# EAGLE design solar_switch (EAGLE 9.0.1)
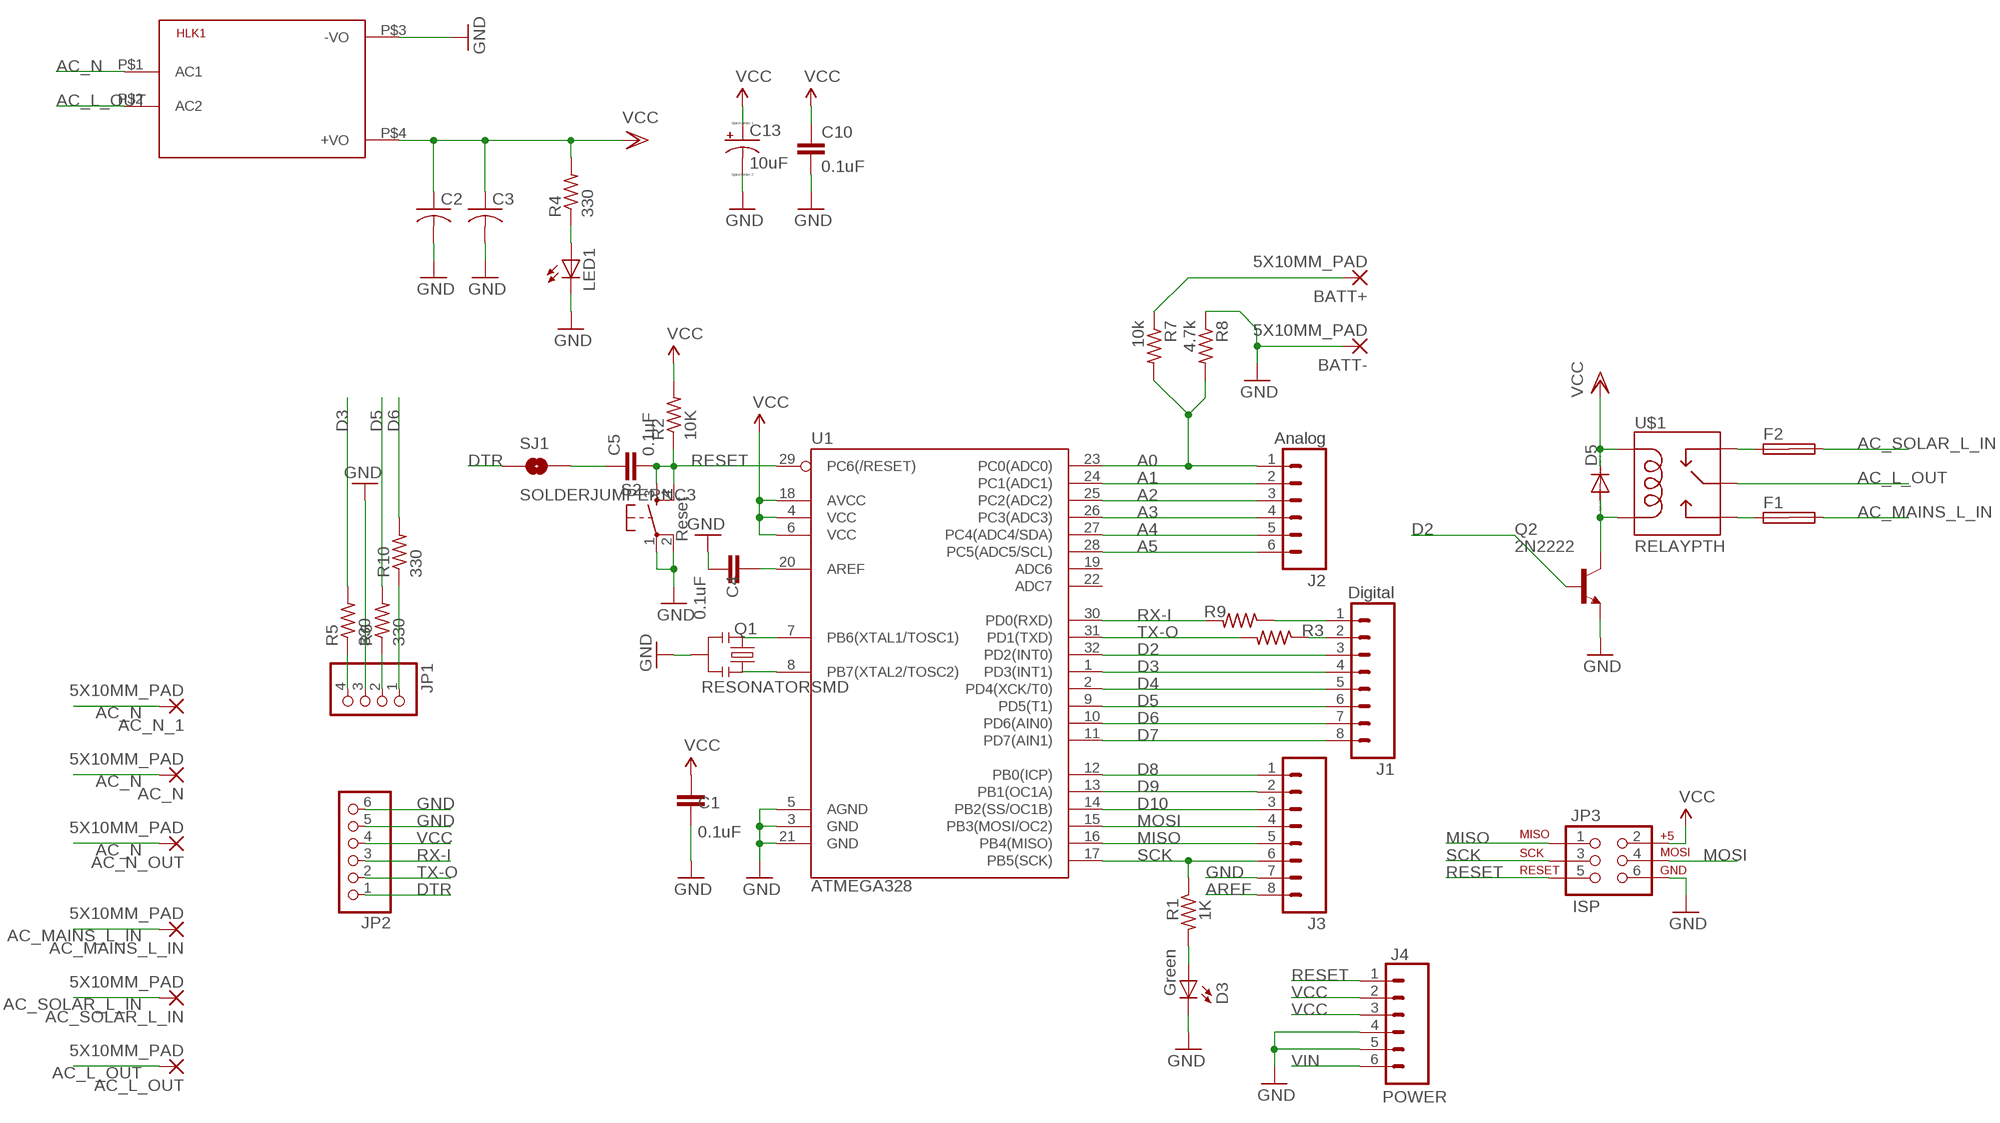
[diagram p0: schematic, sheet 1]

## Parts
AC_L_OUT  5X10MM_PAD  [SMD5-10]
AC_MAINS_L_IN  5X10MM_PAD  [SMD5-10]
AC_N  5X10MM_PAD  [SMD5-10]
AC_N_1  5X10MM_PAD  [SMD5-10]
AC_N_OUT  5X10MM_PAD  [SMD5-10]
AC_SOLAR_L_IN  5X10MM_PAD  [SMD5-10]
BATT+  5X10MM_PAD  [SMD5-10]
BATT-  5X10MM_PAD  [SMD5-10]
C1  0.1uF  C-EUC0805  [C0805]
C2  C-USC0805K  [C0805K]
C3  C-USC0805K  [C0805K]
C4  0.1uF  C-EUC0805  [C0805]
C5  0.1uF  C-EUC0805  [C0805]
C10  0.1uF  C-EUC0805  [C0805]
C13  10uF  CPOL-USB  [PANASONIC_B]
D3  Green  LEDCHIP-LED0805  [CHIP-LED0805]
D5  1N4004  [DO41-10]
F1  SHKOG  [SHKOG]
F2  SHKOG  [SHKOG]
HLK1  HLK-PM013W  [HLK-PM01]
J1  Digital  M081X08  [1X08]
J2  Analog  M06SIP  [1X06]
J3  M081X08  [1X08]
J4  POWER  M06SIP  [1X06]
JP1  PINHD-1X4  [1X04]
JP2  PINHD-1X6  [1X06]
JP3  ISP  AVR_SPI_PRG_6PTH  [2X3]
LED1  LEDCHIPLED_0805  [CHIPLED_0805]
Q1  RESONATORSMD  [RESONATOR-SMD]
Q2  2N2222  [TO18]
R1  1K  R-US_R0805  [R0805]
R2  10K  R-US_R0805  [R0805]
R3  220  R-US_R0805  [R0805]
R4  330  R-US_R0805  [R0805]
R5  330  R-US_R0805  [R0805]
R6  330  R-US_R0805  [R0805]
R7  10k  R-US_M0805  [M0805]
R8  4.7k  R-US_M0805  [M0805]
R9  220  R-US_R0805  [R0805]
R10  330  R-US_R0805  [R0805]
S2  Reset  TAC_SWITCHSMD  [TACTILE_SWITCH_SMD]
SJ1  SOLDERJUMPERNC3  SOLDERJUMPERNC2  [SJ_2S-NOTRACE]
U1  ATMEGA328  ATMEGA168  [TQFP32-08]
U$1  RELAYPTH  [SRD-05VDC-SL-C]

## Nets
A0: J2.1 R7.2 R8.2 U1.23(PC0(ADC0))
A1: J2.2 U1.24(PC1(ADC1))
A2: J2.3 U1.25(PC2(ADC2))
A3: J2.4 U1.26(PC3(ADC3))
A4: J2.5 U1.27(PC4(ADC4/SDA))
A5: J2.6 U1.28(PC5(ADC5/SCL))
AC_L_OUT: AC_L_OUT.1(P) HLK1.P$2(AC2) U$1.SWCOMMON
AC_MAINS_L_IN: AC_MAINS_L_IN.1(P) F1.2A
AC_N: AC_N.1(P) AC_N_1.1(P) AC_N_OUT.1(P) HLK1.P$1(AC1)
AC_SOLAR_L_IN: AC_SOLAR_L_IN.1(P) F2.2A
AREF: C4.2 J3.8 U1.20(AREF)
D2: J1.3 Q2.2(B) U1.32(PD2(INT0))
D3: J1.4 R5.2 U1.1(PD3(INT1))
D4: J1.5 U1.2(PD4(XCK/T0))
D5: J1.6 R6.2 U1.9(PD5(T1))
D6: J1.7 R10.2 U1.10(PD6(AIN0))
D7: J1.8 U1.11(PD7(AIN1))
D8: J3.1 U1.12(PB0(ICP))
D9: J3.2 U1.13(PB1(OC1A))
D10: J3.3 U1.14(PB2(SS/OC1B))
DTR: JP2.1 SJ1.1
GND: BATT-.1(P) C1.1 C2.2 C3.2 C4.1 C10.2 C13.- D3.C HLK1.P$3(-VO) J3.7 J4.4 J4.5 JP1.3 JP2.5 JP2.6 JP3.6 LED1.C Q1.2 Q2.1(E) R8.1 S2.1 S2.2 U1.3(GND) U1.5(AGND) U1.21(GND)
MISO: J3.5 JP3.1 U1.16(PB4(MISO))
MOSI: J3.4 JP3.4 U1.15(PB3(MOSI/OC2))
N$1: D3.A R1.2
N$2: C5.1 SJ1.2
N$3: Q1.1 U1.8(PB7(XTAL2/TOSC2))
N$4: Q1.3 U1.7(PB6(XTAL1/TOSC1))
N$6: LED1.A R4.1
N$7: JP1.1 R10.1
N$8: F2.1A U$1.SWCLOSED(SWCLOSE)
N$9: F1.1A U$1.SWOPEN
N$10: JP1.4 R5.1
N$11: JP1.2 R6.1
N$12: D5.A Q2.3(C) U$1.COIL0
N$13: BATT+.1(P) R7.1
RESET: C5.2 J4.1 JP3.5 R2.1 S2.3 S2.4 U1.29(PC6(/RESET))
RX-I: JP2.3 R9.2 U1.30(PD0(RXD))
RX-IP: J1.2 R3.1
SCK: J3.6 JP3.3 R1.1 U1.17(PB5(SCK))
TX-O: JP2.2 R3.2 U1.31(PD1(TXD))
TX-OP: J1.1 R9.1
VCC: C1.2 C2.1 C3.1 C10.1 C13.+ D5.C HLK1.P$4(+VO) J4.2 J4.3 JP2.4 JP3.2 R2.2 R4.2 U1.4(VCC) U1.6(VCC) U1.18(AVCC) U$1.COIL1
VIN [vcc]: J4.6
Unconnected: F1.1B F1.2B F2.1B F2.2B U1.19(ADC6) U1.22(ADC7)

## Library data of the parts
AC_L_OUT AC_MAINS_L_IN AC_N AC_N_1 AC_N_OUT AC_SOLAR_L_IN BATT+ BATT- = _my_lib:5X10MM_PAD
C1 C4 C5 = rcl:C-EU: CAPACITOR, European symbol
C2 C3 = resistor:C-US: CAPACITOR, American symbol
C10 = rcl:C-EU: CAPACITOR, European symbol; SPICEPREFIX: C
C13 = resistor:CPOL-US: POLARIZED CAPACITOR, American symbol
D3 = adafruit:LED: LED
D5 = diode:1N4004: DIODE general purpose rectifier, 1 A
F1 F2 = fuse:SHKOG: FUSE HOLDER 5 x 20/6 x 32 mm, SH contact, OG 46G6083 Buerklin; OC_FARNELL: unknown; OC_NEWARK: unknown
HLK1 = HLK-PM01:HLK-PM01: Hi-Link Power Supply HLK-PM01 3W Author: Ahmed Said <https://github.com/AhmedSaid/EAGLELibraries>
J1 J3 = SparkFun:M08: Header 8 Standard 8-pin 0.1" header. Use with straight break away headers (SKU : PRT-00116), right angle break away headers (PRT-00553), swiss pins (PRT-00743), machine pins (PRT-00117), and female headers (PRT-00115).
J2 J4 = SparkFun:M06: Header 6 Standard 6-pin 0.1" header. Use with straight break away headers (SKU : PRT-00116), right angle break away headers (PRT-00553), swiss pins (PRT-00743), machine pins (PRT-00117), and female headers (PRT-00115). Molex polarized connector foot print use with SKU : PRT-08094 with associated crimp pins and housings. NOTES ON THE VARIANTS LOCK and LOCK_LONGPADS... This footprint was designed to help hold the alignment of a through-hole component (i.e. 6-pin header) while soldering it into place. You may notice that each hole has been shifted either up or down by 0.005 of an inch from it's more standard position (which is a perfectly straight line). This slight alteration caused the pins (the squares in the middle) to touch the edges of the holes. Because they are alternating, it causes a "brace" to hold the component in place. 0.005 has proven to be the perfect amount of "off-center" position when using our standard breakaway headers. Although looks a little odd when you look at the bare footprint, once you have a header in there, the alteration is very hard to notice. Also, if you push a header all the way into place, it is covered up entirely on the bottom side. This idea of altering the position of holes to aid alignment will be further integrated into the Sparkfun Library for other footprints. It can help hold any component with 3 or more connection pins.
JP1 = pinhead:PINHD-1X4: PIN HEADER
JP2 = pinhead:PINHD-1X6: PIN HEADER
JP3 = SparkFun:AVR_SPI_PRG_6: AVR ISP 6 Pin This is the reduced ISP connector for AVR programming. Common on Arduino. This footprint will take up less PCB space and can be used with a 10-pin to 6-pin adapter such as SKU: BOB-08508
LED1 = led:LED: LED
Q1 = SparkFun:RESONATOR: Resonator Small SMD resonator. This is the itty bitty 10/20MHz resonators with built in caps. CSTCE10M0G55 and CSTCE20M0V53. Footprint has been reviewed closely but hasn't been tested yet.
Q2 = transistor-npn:2N2222*: NPN Transistor
R1-R6 R9 R10 = rcl:R-US_: RESISTOR, American symbol
R7 R8 = resistor:R-US_: RESISTOR, American symbol
S2 = SparkFun:TAC_SWITCH: Momentary Switch Button commonly used for reset or general input. Spark Fun Electronics SKU : COM-00097
SJ1 = SparkFun:SOLDERJUMPER: Solder Jumper Standard SMD solder jumper. Used to automate production. Two varients : Normally Open and Normally Closed are the same, but have different paste layers. NC will have a large amount of paste and should jumper during reflow.
U1 = SparkFun:ATMEGA168
U$1 = SRD-05VDC-SL-C:RELAY: SPDT relay (COM-00101)

## Net classes
0 default: width 0.203 mm
1 vcc: width 0.254 mm

## Board
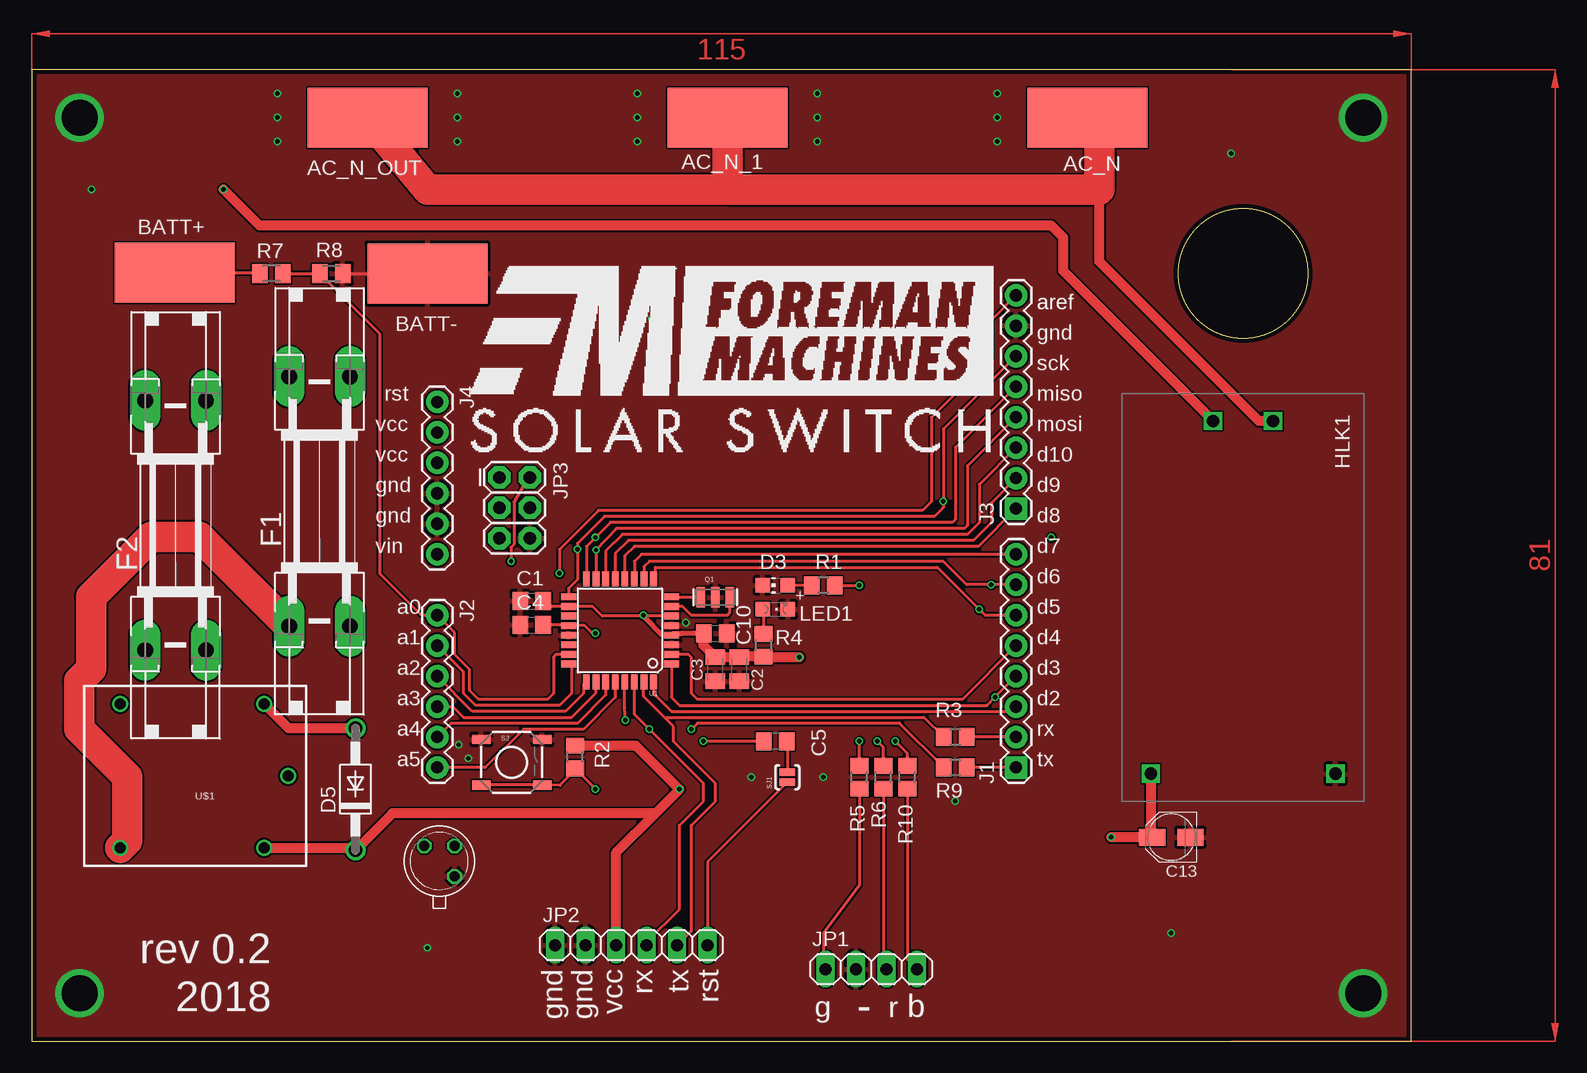
[diagram p1: board, top side]
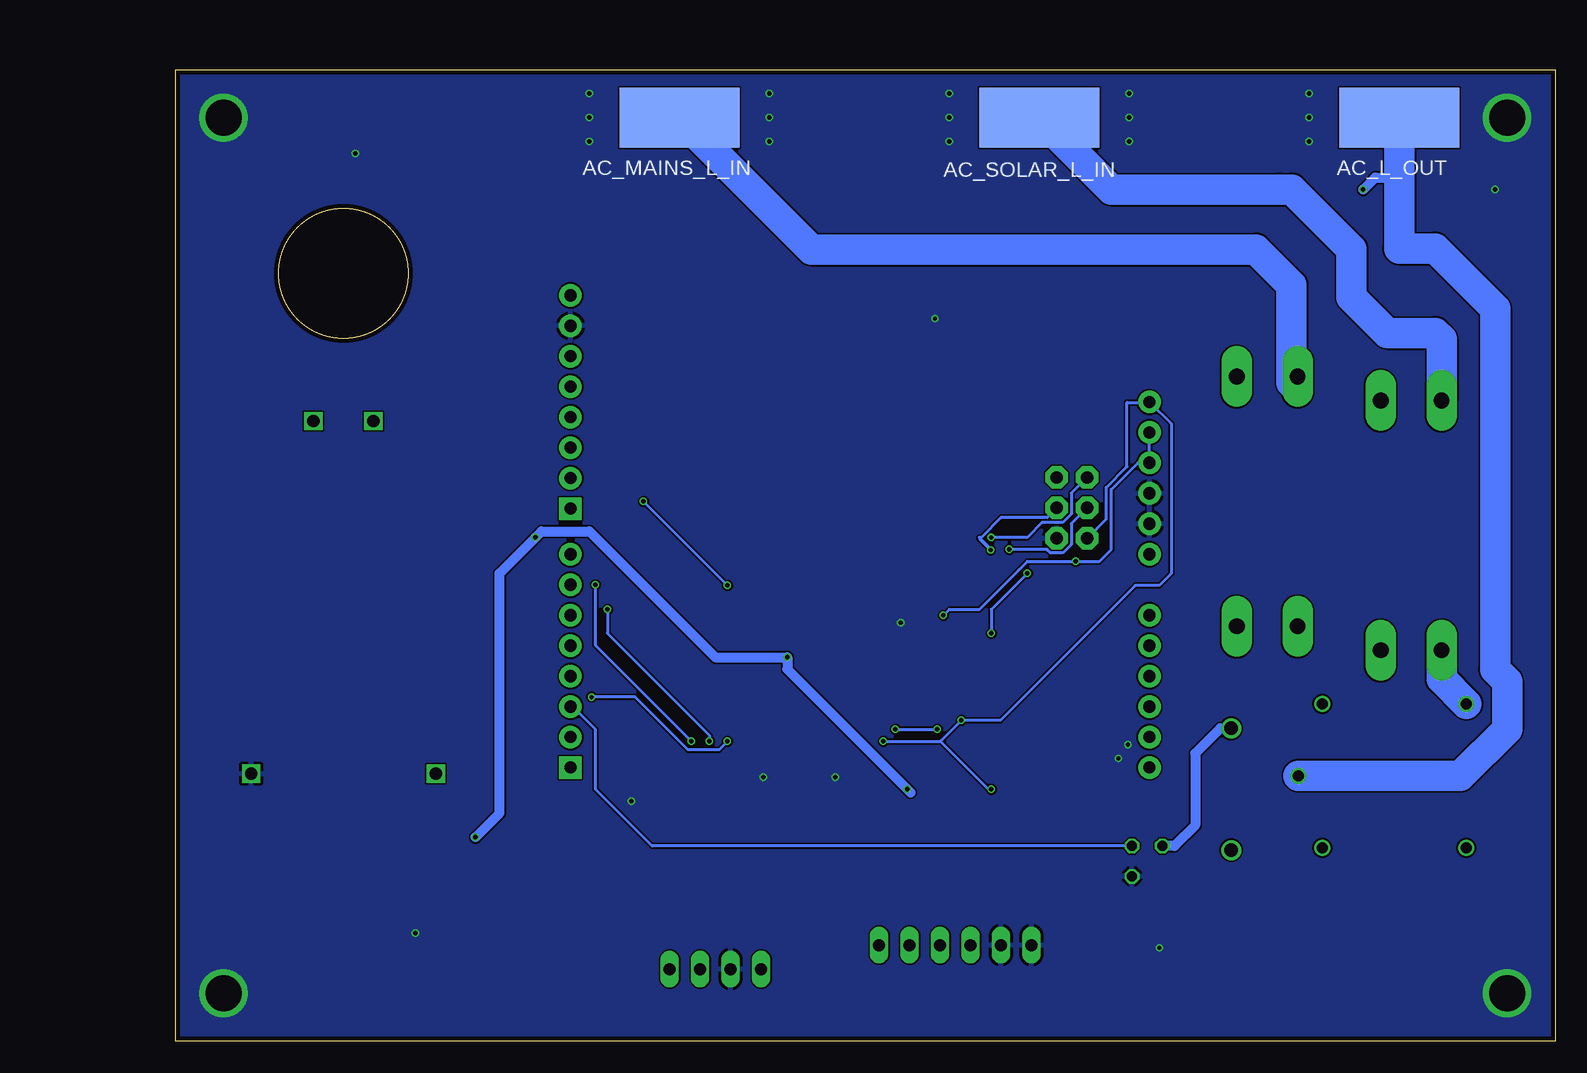
[diagram p2: board, bottom side, seen from below]

Size 115 x 81 mm. Coordinates in mm from the lower left corner, seen from the top.
Outline: 0,0 115,0 115,81 0,81 0,0
Outline: circle at 101,64 radius 5.39
Copper layers (1*16): Top 0.035559375mm / dielectric 1.6mm / Bottom 0.035559375mm
Design rules "oshpark-2layer": minimum track width 6mil, minimum drill 10mil, track to track 6mil, track to pad 6mil, pad to pad 6mil, via to via 6mil, smd to smd 6mil, copper to edge 15mil, drill to drill 6mil, minimum pad ring 5mil, minimum via ring 5mil, stop-mask expansion 2.5mil, vias tented up to drill 0mil, thermal gap 10mil

### Footprints (pad centres in the part's own frame; a part is rotated, then mirrored left to right if it is on the bottom)
SMD5-10 = smd 5 x 10: 1 0,0
C0805 = smd 1.3 x 1.5: 1 -0.95,0; 2 0.95,0
C0805K = smd 1.3 x 1.6: 1 -1,0; 2 1,0
PANASONIC_B = smd 2.2 x 1.4: + 1.6,0; - -1.6,0
CHIP-LED0805 = smd 1.2 x 1.2: A 0,-1.05; C 0,1.05
DO41-10 = drill 1.118: A 5.08,0; C -5.08,0
SHKOG = drill 1.321 pad 2.54 long: 1A -10.414,2.54; 1B -10.414,-2.54; 2A 10.414,2.54; 2B 10.414,-2.54
HLK-PM01 = drill 1.016 square: P$1 -14.7,2.5; P$2 -14.7,-2.5; P$3 14.7,7.7; P$4 14.7,-7.7
1X08 = drill 1.016 pad 1.88 square: 1 0,0 | drill 1.016 pad 1.88: 2 2.54,0; 3 5.08,0; 4 7.62,0; 5 10.16,0; 6 12.7,0; 7 15.24,0; 8 17.78,0
1X06 = drill 1.016 pad 1.88: 1 0,0; 2 2.54,0; 3 5.08,0; 4 7.62,0; 5 10.16,0; 6 12.7,0
1X04 = drill 1.016 long: 1 -3.81,0; 2 -1.27,0; 3 1.27,0; 4 3.81,0
1X06' = drill 1.016 long: 1 -6.35,0; 2 -3.81,0; 3 -1.27,0; 4 1.27,0; 5 3.81,0; 6 6.35,0
2X3 = drill 1.016 pad 1.88 octagon: 1 0,0; 2 0,2.54; 3 2.54,0; 4 2.54,2.54; 5 5.08,0; 6 5.08,2.54
CHIPLED_0805 = smd 1.2 x 1.2: A 0,-1.05; C 0,1.05
RESONATOR-SMD = smd 0.7 x 1.7: 1 -1.2,0; 2 0,0; 3 1.2,0
TO18 = drill 0.813 octagon: 1 -1.27,-1.27; 2 1.27,-1.27; 3 1.27,1.27
R0805 = smd 1.3 x 1.5: 1 -0.95,0; 2 0.95,0
M0805 = smd 1.3 x 1.6: 1 -0.95,0; 2 0.95,0
TACTILE_SWITCH_SMD = smd 1.524 x 0.762: 1 -2.54,1.905; 2 2.54,1.905; 3 -2.54,-1.905; 4 2.54,-1.905
SJ_2S-NOTRACE = smd 0.635 x 1.27: 1 -0.401,0; 2 0.413,0
TQFP32-08 = smd 1.27 x 0.559: 1 -4.293,2.8; 2 -4.293,2; 3 -4.293,1.2; 4 -4.293,0.4; 5 -4.293,-0.4; 6 -4.293,-1.2; 7 -4.293,-2; 8 -4.293,-2.8; 17 4.293,-2.8; 18 4.293,-2; 19 4.293,-1.2; 20 4.293,-0.4; 21 4.293,0.4; 22 4.293,1.2; 23 4.293,2; 24 4.293,2.8 | smd 0.559 x 1.27: 9 -2.8,-4.293; 10 -2,-4.293; 11 -1.2,-4.293; 12 -0.4,-4.293; 13 0.4,-4.293; 14 1.2,-4.293; 15 2,-4.293; 16 2.8,-4.293; 25 2.8,4.293; 26 2,4.293; 27 1.2,4.293; 28 0.4,4.293; 29 -0.4,4.293; 30 -1.2,4.293; 31 -2,4.293; 32 -2.8,4.293
SRD-05VDC-SL-C = drill 0.9: COIL0 -5.39,-6.12; COIL1 -5.39,5.88; SWCLOSED 6.61,-6.12; SWCOMMON -7.39,-0.12; SWOPEN 6.61,5.88

### Placement (x,y rotation side)
AC_L_OUT  13,77 90 bottom
AC_MAINS_L_IN  73,77 90 bottom
AC_N  88,77 270 top
AC_N_1  58,77 90 top
AC_N_OUT  28,77 90 top
AC_SOLAR_L_IN  43,77 270 bottom
BATT+  11.93,64.07 90 top
BATT-  33,64 90 top
C1  41.69,36.7 0 top
C2  59,31 270 top
C3  57,31 270 top
C4  41.69,34.7 0 top
C5  62,25 180 top
C10  57,34 0 top
C13  95,17 180 top
D3  62,38 90 top
D5  27,21 90 top
F1  24,45 90 top
F2  12,43 90 top
HLK1  101,37 270 top
J1  82.07,22.81 90 top
J2  33.81,35.51 270 top
J3  82.07,44.4 90 top
J4  33.81,53.29 270 top
JP1  70,6 180 top
JP2  [1X06']  50,8 180 top
JP3  39,47 270 top
LED1  62,36 270 top
Q1  57,37 0 top
Q2  34,15 90 top
R1  66,38 180 top
R2  45.3,23.69 90 top
R3  76.99,25.35 180 top
R4  61,33 270 top
R5  69,22 90 top
R6  71,22 90 top
R7  20,64 0 top
R8  25,64 180 top
R9  76.99,22.81 180 top
R10  73,22 90 top
S2  40.03,23.25 0 top
SJ1  63,22 90 top
U1  49.05,34.24 180 top
U$1  14,22 180 top

### Tracks (layer width: path | path; a pad name or v marks a point on that pad's centre or on a via)
A0
  Top 0.254: U1.23 43.74,32.24 43.5,32 43.5,29 43,28.5 37.25,28.5 36.5,29.25 36.5,31 35.25,32.25 35.25,34.07 J2.1 32.49,35.51 29,39 29,59 24.05,63.95 R8.2 R7.2
A1
  Top 0.254: U1.24 45,31.2 45,29 44,28 37,28 36,29 36,30.78 J2.2
A2
  Top 0.254: U1.25 46,29.7 46,29 44.5,27.5 36.74,27.5 J2.3
A3
  Top 0.254: J2.4 35.11,27.89 36,27 45,27 47.05,29.05 U1.26
A4
  Top 0.254: U1.27 47.85,28.85 45.5,26.5 34.96,26.5 J2.5
A5
  Top 0.254: U1.28 48.65,28.65 46,26 41,26 37.81,22.81 J2.6
AC_L_OUT  (via drill 0.35)
  Top 0.813: HLK1.P$2 86,64.2 86,67 85,68 19,68 v16,71
  Bottom 0.813: v16,71 15,72 13,72
  Bottom 2.54: AC_L_OUT.1 13,72 13,66.08 10,66.08 5,61.08 5,31 4,30 4,26 7.88,22.12 U$1.SWCOMMON
AC_MAINS_L_IN
  Bottom 2.54: AC_MAINS_L_IN.1 62,66 24.93,66 21.97,63.03 21.97,54.92 F1.2A
AC_N
  Top 0.813: HLK1.P$1 102.3,51.7 89,65 89,71
  Top 2.54: 58,71 89,71 89,76 AC_N.1 | AC_N_1.1 58,71 | AC_N_OUT.1 33,71 58,71
AC_SOLAR_L_IN
  Bottom 2.54: AC_SOLAR_L_IN.1 37,71 23,71 21.93,71 16.97,66.03 16.97,64.03 16.97,62.03 13.97,59.03 9.97,59.03 9.46,58.53 F2.2A
AREF  (via drill 0.35)
  Top 0.254: C4.2 44.7,34.7 U1.20 46.11,34.64 46.75,34 v47,34 | J3.8 80,60.11 80,57 75,52 75,45 74.25,44.25 47.25,44.25 44,41 v44,39
  Bottom 0.254: v44,39 47,36 v47,34
D2
  Top 0.254: U1.32 51.85,29 | 51.85,29 51.85,28.9 | 51.85,29 53.35,27.5 81.68,27.5 J1.3
  Bottom 0.254: Q2.2 75.27,16.27 80,21 80,26 81.89,27.89 J1.3
D3  (via drill 0.35)
  Top 0.254: U1.1 53.34,28.66 54,28 79.64,28 v80.32,28.68 J1.4 | R5.2 v69,25
  Bottom 0.254: v69,25 69.71,24.29 72.29,24.29 76.68,28.68 v80.32,28.68
D4
  Top 0.254: U1.2 54.76,32.24 55,32 55,29 55.5,28.5 77.6,28.5 J1.5
D5  (via drill 0.35)
  Top 0.254: J1.6 79.49,35.51 v79,36 75.5,39.5 52,39.5 52,38.68 U1.9 | R6.2 71,24.5 v70.5,25
  Bottom 0.254: v79,36 79,34 70.5,25.5 v70.5,25
D6  (via drill 0.35)
  Top 0.254: J1.7 v80,38.05 77.95,38.05 76,40 51.5,40 51.05,39.55 U1.10 51.05,38.95 51,39 | R10.2 73,24 v72,25
  Bottom 0.254: v72,25 80,33 v80,38.05
D7
  Top 0.254: J1.8 50.84,40.59 50.25,40 U1.11
D8
  Top 0.254: J3.1 78.92,41.25 50.25,41.25 49.45,40.45 U1.12
D9
  Top 0.254: J3.2 80,44.87 80,43.25 78.5,41.75 49.75,41.75 48.65,40.65 U1.13
D10
  Top 0.254: J3.3 79,46.41 79,43.25 78,42.25 49.25,42.25 47.85,40.85 U1.14
DTR
  Top 0.254: JP2.1 56.35,14.95 SJ1.1
GND  (via drill 0.35, 3)
  Top 0.254: R8.1 31.93,64 31.97,64.03 32.97,64.03 BATT-.1
  other vias: 4,4 111,4 111,77 4,77 60,22 66,22 77,20 5,71 100,74 51.7,60.24 95,9 32.99,7.77 80.5,75 80.5,77 80.5,79 20.5,75 20.5,77 20.5,79 35.5,75 35.5,77 35.5,79 50.5,75 50.5,77 50.5,79 65.5,75 65.5,77 65.5,79 54.54,34.89 36.41,23.58 35.6,24.72
  pour Top: -22.03,104.53 143.47,107.53 143.47,-17.97 -21.03,-17.97
  pour Bottom: -25.03,108.03 144.97,109.03 144.97,-19.47 -26.03,-20.97
MISO  (via drill 0.35)
  Top 0.254: J3.5 77,49.49 77,43.5 76.75,43.25 48.25,43.25 v47,42 | v47,42 46.25,41.25 U1.16 | v47,42
  Bottom 0.254: v47,42 44,42 42.76,43.24 41.04,43.24 40.32,43.95 40.32,45.68 JP3.1
MOSI  (via drill 0.35)
  Top 0.254: J3.4 78,47.95 78,43 77.75,42.75 48.75,42.75 v47.05,40.95 U1.15
  Bottom 0.254: 47.97,41.87 v47.05,40.95 47.05,41.05 47.29,41.29 47.71,41.71 48,42 47.82,42 46.18,43.65 42.35,43.65 JP3.4
N$1
  Top 0.254: R1.2 D3.A
N$2
  Top 0.254: C5.1 63,24.95 SJ1.2
N$3
  Top 0.254: U1.8 55.76,37.04 Q1.1
N$4
  Top 0.254: Q1.3 58.2,35.7 58,35.5 55,35.5 54.26,36.24 U1.7
N$6
  Top 0.254: LED1.A 61,35.95 R4.1
N$7
  Top 0.254: R10.1 73,6.81 JP1.1
N$8
  Bottom 2.54: U$1.SWCLOSED 9.46,30.19 F2.1A
N$9
  Top 2.54: F1.1A 14.01,42.03 9.97,42.03 4.97,37.03 4.97,31.03 3.97,30.03 3.97,26.03 7.97,22.03 7.97,16.7 U$1.SWOPEN
N$10
  Top 0.254: 66.19,7.24 JP1.4 66,6.19 66,9 69,13 R5.1
N$11
  Top 0.254: R6.1 71,6.27 JP1.2
N$12
  Top 0.813: D5.A 21.43,26.08 U$1.COIL0
  Bottom 0.813: D5.A 27.92,26.08 30,24 30,18 31.73,16.27 Q2.3
N$13
  Top 0.254: BATT+.1 18.98,64.07 R7.1
RESET  (via drill 0.35)
  Top 0.254: C5.2 v56,25 | v49.5,26.75 49.45,27.8 U1.29 49.5,30 | 44.07,21.32 44.01,21.32 | 44.01,21.32 S2.4 S2.3 | J4.1 33.84,53.26 | 44.01,21.32 45.3,22.62 R2.1 47,21.04 v47,21
  Bottom 0.254: v56,25 51.25,25 | 51.25,25 v49.5,26.75 46.25,26.75 35,38 33,38 32,39 32,51.48 33.76,53.24 | v47,21 47.25,21 51.25,25 | J4.1 33.76,53.24 | 33.76,53.24 35.68,53.24 35.68,47.9 37.41,46.17 37.41,43.51 JP3.5
RX-I  (via drill 0.35)
  Top 0.254: 50.32,29.88 U1.30 50.25,27.25 v51.5,26 56,21.5 56,20 54,18 54,11 51.27,8.27 JP2.3 | R9.2 72.35,26.5 55.5,26.5 v55,26
  Bottom 0.254: v55,26 v51.5,26
RX-IP
  Top 0.254: J1.2 R3.1
SCK  (via drill 0.35)
  Top 0.254: J3.6 76,51.03 v76,45 76,44.5 75.25,43.75 47.75,43.75 45.5,41.5 v45.5,41 45.5,38.5 44.76,37.76 U1.17 | R1.1 v69,38
  Bottom 0.254: v69,38 v76,45 | JP3.3 40.32,43.14 40.32,41.41 41.04,40.7 42.05,40.7 42.34,41 v45.5,41
TX-O
  Top 0.254: 52.88,26.88 51,28.75 51,29.9 U1.31 | 52.88,26.88 53,27 74.39,27 R3.2 | JP2.2 55,9.19 55,18 57,20 57,21.5 53.5,25 53.5,26.25 52.88,26.88
TX-OP
  Top 0.254: J1.1 R9.1
VCC  (via drill 0.35)
  Top 0.254: C1.2 43.1,36.24 U1.18 46.76,36.24 47.56,35.44 51,35.44 | C10.1 56,34 | 53.5,34 U1.4 | U1.6 51,35.44 | v51,35.5 51,35.44 | 45.9,24.64 R2.2 | JP3.2 40.97,46.43 40.97,46.22 40.22,44.97 40.22,41.41 39.97,41.16 v39.97,40
  Top 0.406: C10.1 54.19,34 54.15,33.95 53.46,33.95 U1.4 52.6,33.84 51,35.44
  Top 0.813: 56,34 56,33 C3.1 C2.1 59.05,32.05 R4.2 61.05,32 v64,32 | U$1.COIL1 26.8,16.12 D5.C 30.08,19 52,19 | R2.2 50.36,24.64 v54,21 52,19 | JP2.4 48.73,15.73 52,19 | HLK1.P$4 93.3,17.1 C13.+ v90,17
  Bottom 0.254: v51,35.5 50.5,36 48,36 44.71,39.29 44,40 v39.97,40 38,40 37,41 37,46 34.79,48.21 J4.3 J4.2
  Bottom 0.813: 53.73,20.73 v54,21 64,31 v64,32 70,32 80.5,42.5 84.5,42.5 v85,42 88,39 88,19 v90,17
(copper drawn outside any net)
  shapes: Top area x2

### Text on the board
tPlace: aref | aref | gnd | sck | rst | miso | vcc | mosi | vcc | d10 | gnd | d9 | gnd | d8 | vin | d7 | d6 | a0 | d5 | a1 | d4 | a2 | d3 | a3 | d2 | a4 | rx | a5 | tx
tNames: rev 0.2 | gnd | gnd | vcc | rx | tx | rst | 2018 | - | r | g | b